# Altium project ECUCheater_New.PrjPCB
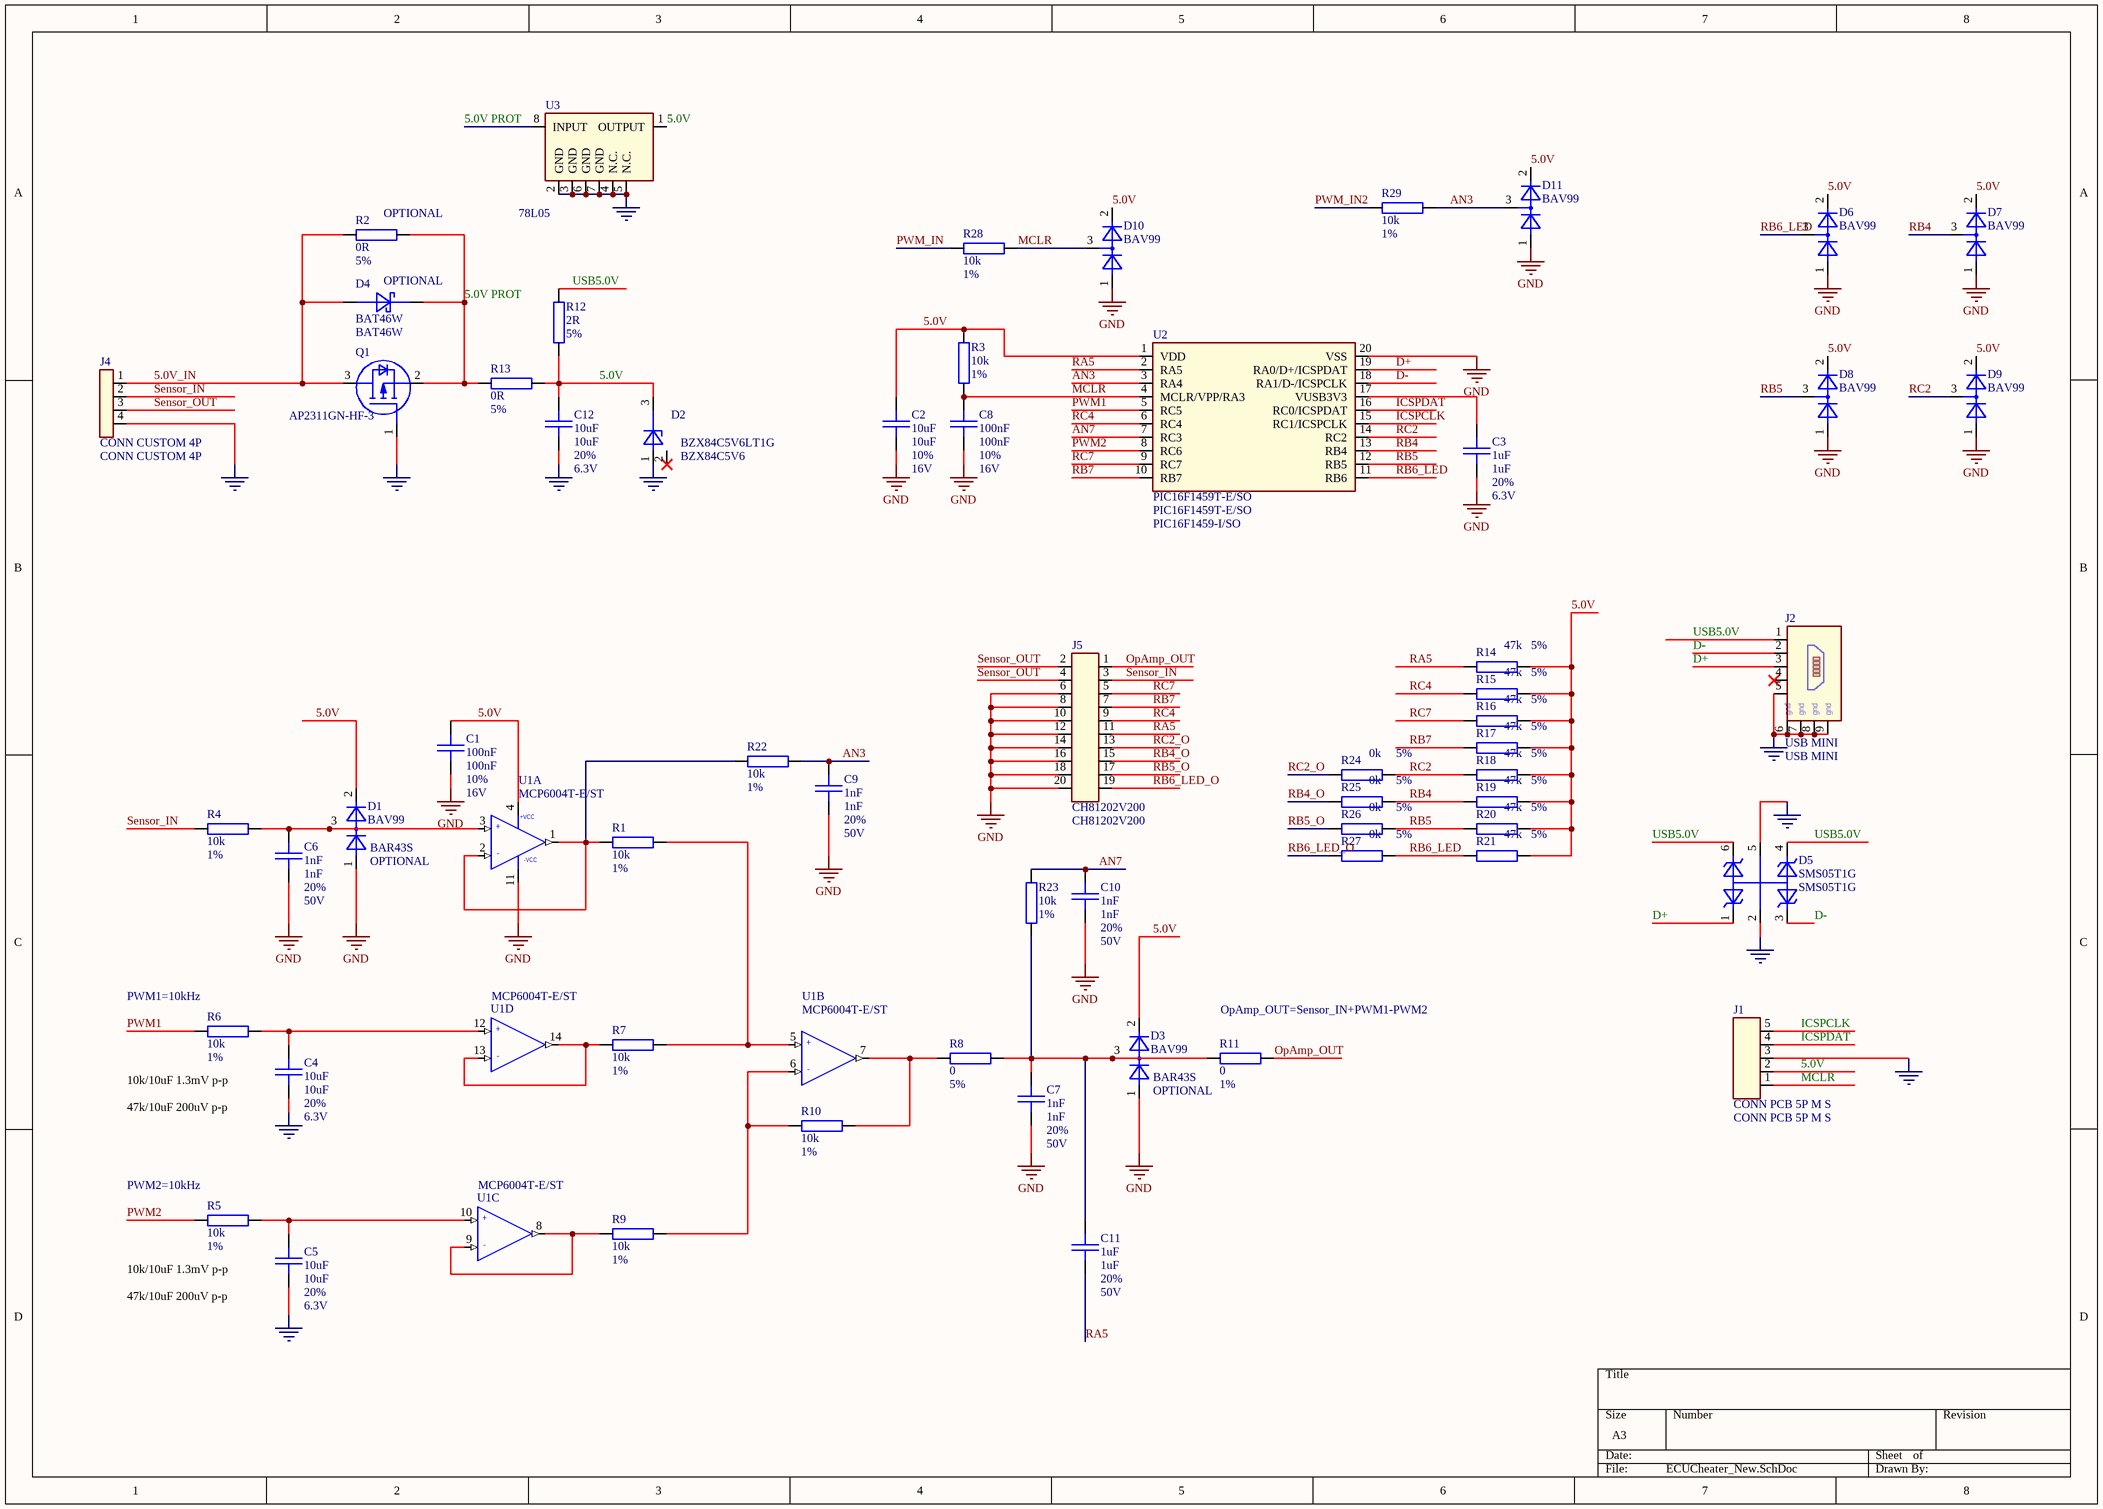
[diagram p0: ECUCheater_New.SchDoc]
1 sheet, 60 parts. Net scope: flat (ports and power ports of the same name join across sheets).
Board file: ECUCheater_New.PcbDoc

## Sheet ECUCheater_New.SchDoc
size A3

### Parts
C1  100nF  DB_TOLERANCE: 10%  DB_VOLTAGE: 16V  [SMD_0805_CAPC2012X145N]
C2  10uF  DB_TOLERANCE: 10%  DB_VOLTAGE: 16V  [SMD_0805_CAPC2012X145N]
C3  1uF  DB_TOLERANCE: 20%  DB_VOLTAGE: 6.3V  [SMD_0805_CAPC2012X145N]
C4  10uF  DB_TOLERANCE: 20%  DB_VOLTAGE: 6.3V  [SMD_0805_CAPC2012X145N]
C5  10uF  DB_TOLERANCE: 20%  DB_VOLTAGE: 6.3V  [SMD_0805_CAPC2012X145N]
C6  1nF  DB_TOLERANCE: 20%  DB_VOLTAGE: 50V  [SMD_0805_CAPC2012X145N]
C7  1nF  DB_TOLERANCE: 20%  DB_VOLTAGE: 50V  [SMD_0805_CAPC2012X145N]
C8  100nF  DB_TOLERANCE: 10%  DB_VOLTAGE: 16V  [SMD_0805_CAPC2012X145N]
C9  1nF  DB_TOLERANCE: 20%  DB_VOLTAGE: 50V  [SMD_0805_CAPC2012X145N]
C10  1nF  DB_TOLERANCE: 20%  DB_VOLTAGE: 50V  [SMD_0805_CAPC2012X145N]
C11  1uF  DB_TOLERANCE: 20%  DB_VOLTAGE: 50V  [SMD_0805_CAPC2012X145N]
C12  10uF  DB_TOLERANCE: 20%  DB_VOLTAGE: 6.3V  [SMD_0805_CAPC2012X145N]
D1  BAV99  [SMD_SOT23_SOT92P240X110-3N]
D2  BZX84C5V6LT1G  [SMD_SOT23_SOT95P240X112-3N]
D3  BAV99  [SMD_SOT23_SOT92P240X110-3N]
D4  BAT46W  [SMD_R_SOD123_SOD3715X145N]
D5  SMS05T1G  [SMD_SOT95P280X145-6N-W]
D6  BAV99  [SMD_SOT23_SOT92P240X110-3N]
D7  BAV99  [SMD_SOT23_SOT92P240X110-3N]
D8  BAV99  [SMD_SOT23_SOT92P240X110-3N]
D9  BAV99  [SMD_SOT23_SOT92P240X110-3N]
D10  BAV99  [SMD_SOT23_SOT92P240X110-3N]
D11  BAV99  [SMD_SOT23_SOT92P240X110-3N]
J1  CONN PCB 5P M S  [SIP5 - PGM]
J2  USB MINI  [SMD_CON-CVILUX-CU04-SCM15B0]
J4  CONN CUSTOM 4P  [PTH_CON_CUSTOM_10]
J5  CH81202V200  [PTH_HDRV40W6240P254_2X10_M]
Q1  BSH202  [SMD_SOT23_SOT95P230X110-3N]  (value not drawn)
R1  DB_TOLERANCE: 1%  [SMD_0805_RESC2012X130N]  (hidden comment: 10k)
R2  DB_TOLERANCE: 5%  [SMD_1206_RESC3216X65N]  (hidden comment: 0R)
R3  DB_TOLERANCE: 1%  [SMD_0805_RESC2012X130N]  (hidden comment: 10k)
R4  DB_TOLERANCE: 1%  [SMD_0805_RESC2012X130N]  (hidden comment: 10k)
R5  DB_TOLERANCE: 1%  [SMD_0805_RESC2012X130N]  (hidden comment: 10k)
R6  DB_TOLERANCE: 1%  [SMD_0805_RESC2012X130N]  (hidden comment: 10k)
R7  DB_TOLERANCE: 1%  [SMD_0805_RESC2012X130N]  (hidden comment: 10k)
R8  DB_TOLERANCE: 5%  [SMD_0805_RESC2012X130N]  (hidden comment: 0)
R9  DB_TOLERANCE: 1%  [SMD_0805_RESC2012X130N]  (hidden comment: 10k)
R10  DB_TOLERANCE: 1%  [SMD_0805_RESC2012X130N]  (hidden comment: 10k)
R11  DB_TOLERANCE: 1%  [SMD_0805_RESC2012X130N]  (hidden comment: 0)
R12  DB_TOLERANCE: 5%  [SMD_1206_RESC3216X65N]  (hidden comment: 2R)
R13  DB_TOLERANCE: 5%  [SMD_1206_RESC3216X65N]  (hidden comment: 0R)
R14  DB_TOLERANCE: 5%  [SMD_0805_RESC2012X130N]  (hidden comment: 47k)
R15  DB_TOLERANCE: 5%  [SMD_0805_RESC2012X130N]  (hidden comment: 47k)
R16  DB_TOLERANCE: 5%  [SMD_0805_RESC2012X130N]  (hidden comment: 47k)
R17  DB_TOLERANCE: 5%  [SMD_0805_RESC2012X130N]  (hidden comment: 47k)
R18  DB_TOLERANCE: 5%  [SMD_0805_RESC2012X130N]  (hidden comment: 47k)
R19  DB_TOLERANCE: 5%  [SMD_0805_RESC2012X130N]  (hidden comment: 47k)
R20  DB_TOLERANCE: 5%  [SMD_0805_RESC2012X130N]  (hidden comment: 47k)
R21  DB_TOLERANCE: 5%  [SMD_0805_RESC2012X130N]  (hidden comment: 47k)
R22  DB_TOLERANCE: 1%  [SMD_0805_RESC2012X130N]  (hidden comment: 10k)
R23  DB_TOLERANCE: 1%  [SMD_0805_RESC2012X130N]  (hidden comment: 10k)
R24  DB_TOLERANCE: 5%  [SMD_0805_RESC2012X130N]  (hidden comment: 0k)
R25  DB_TOLERANCE: 5%  [SMD_0805_RESC2012X130N]  (hidden comment: 0k)
R26  DB_TOLERANCE: 5%  [SMD_0805_RESC2012X130N]  (hidden comment: 0k)
R27  DB_TOLERANCE: 5%  [SMD_0805_RESC2012X130N]  (hidden comment: 0k)
R28  DB_TOLERANCE: 1%  [SMD_0805_RESC2012X130N]  (hidden comment: 10k)
R29  DB_TOLERANCE: 1%  [SMD_0805_RESC2012X130N]  (hidden comment: 10k)
U1  MCP6004T-E/ST  [SMD_SOIC127P600X175-14N]  (parts A,B,C,D of 4)
U2  PIC16F1459T-E/SO  [SMD_SOIC127P1030X265-20N]
U3  78L05  [SMD_SOIC127P602X173-8N]

### Nets
GND: C1.2 C2.2 C3.2 C4.2 C5.2 C6.2 C7.2 C8.2 C9.2 C10.2 C12.2 D1.1(A) D2.1(A) D3.1(A) D5.2 D5.5 D6.1(A) D7.1(A) D8.1(A) D9.1(A) D10.1(A) D11.1(A) J1.3 J2.5 J2.6 J2.7 J2.8 J2.9 J4.4 J5.6 J5.8 J5.10 J5.12 J5.14 J5.16 J5.18 J5.20 Q1.1(G) U1.11(-VCC) U2.20(VSS) U3.2(GND) U3.3(GND) U3.4(N.C.) U3.5(N.C.) U3.6(GND) U3.7(GND)
5.0V: C1.1 C2.1 C12.1 D1.2(C) D2.3(C) D3.2(C) D6.2(C) D7.2(C) D8.2(C) D9.2(C) D10.2(C) D11.2(C) J1.2 R3.2 R12.1 R13.1 R14.2 R15.2 R16.2 R17.2 R18.2 R19.2 R20.2 R21.2 U1.4(+VCC) U2.1(VDD) U3.1(OUTPUT)
5.0V PROT: D4.1(C) Q1.2(S) R2.1 R13.2 U3.8(INPUT)
5.0V_IN: D4.2(A) J4.1 Q1.3(D) R2.2
AN3: C9.1 D11.3(AC) R22.1 R29.1 U2.3(RA4)
AN7: C10.1 R23.1 U2.7(RC3)
D+: D5.1 J2.3 U2.19(RA0/D+/ICSPDAT)
D-: D5.3 J2.2 U2.18(RA1/D-/ICSPCLK)
ICSPCLK: J1.5 U2.15(RC1/ICSPCLK)
ICSPDAT: J1.4 U2.16(RC0/ICSPDAT)
MCLR: C8.1 D10.3(AC) J1.1 R3.1 R28.1 U2.4(MCLR/VPP/RA3)
OpAmp_OUT: J5.1 R11.1
PWM1: R6.2 U2.5(RC5)
PWM2: R5.2 U2.8(RC6)
PWM_IN: R28.2
PWM_IN2: R29.2
RA5: C11.2 J5.11 R14.1 U2.2(RA5)
RB4: D7.3(AC) R19.1 R25.2 U2.13(RB4)
RB4_O: J5.15 R25.1
RB5: D8.3(AC) R20.1 R26.2 U2.12(RB5)
RB5_O: J5.17 R26.1
RB6_LED: D6.3(AC) R21.1 R27.2 U2.11(RB6)
RB6_LED_O: J5.19 R27.1
RB7: J5.7 R17.1 U2.10(RB7)
RC2: D9.3(AC) R18.1 R24.2 U2.14(RC2)
RC2_O: J5.13 R24.1
RC4: J5.9 R15.1 U2.6(RC4)
RC7: J5.5 R16.1 U2.9(RC7)
Sensor_IN: J4.2 J5.3 R4.2
Sensor_OUT: J4.3 J5.2 J5.4
USB5.0V: D5.4 D5.6 J2.1 R12.2
NetC3_1: C3.1 U2.17(VUSB3V3)
NetC4_1: C4.1 R6.1 U1.12(+IN)
NetC5_1: C5.1 R5.1 U1.10(+IN)
NetC6_1: C6.1 D1.3(AC) R4.1 U1.3(+IN)
NetC7_1: C7.1 C11.1 D3.3(AC) R8.1 R11.2 R23.2
NetR1_1: R1.1 R7.1 U1.5(+IN)
NetR1_2: R1.2 R22.2 U1.1(OUT) U1.2(-IN)
NetR7_2: R7.2 U1.13(-IN) U1.14(OUT)
NetR8_2: R8.2 R10.1 U1.7(OUT)
NetR9_1: R9.1 R10.2 U1.6(-IN)
NetR9_2: R9.2 U1.8(OUT) U1.9(-IN)

Not connected (* = marked no-connect by the designer): D2 2(NC)*; J2 4*

### Notes on the sheet
- (near R2) OPTIONAL
- (near D4) OPTIONAL
- (near Q1) AP2311GN-HF-3
- (near D2) BZX84C5V6
- (near U2) PIC16F1459-I/SO
- (near D1) BAR43S
- (near D1) OPTIONAL
- (near R6) PWM1=10kHz
- (near R11) OpAmp_OUT=Sensor_IN+PWM1-PWM2
- 10k/10uF 1.3mV p-p
  47k/10uF 200uV p-p
- (near D3) BAR43S
- (near D3) OPTIONAL
- (near R5) PWM2=10kHz
- (in symbol ANA000000050, part A) +; -
- (in symbol ANA000000050, part B) +; -
- (in symbol ANA000000050, part C) +; -
- (in symbol ANA000000050, part D) +; -
- (in symbol CON000000048) gnd

### Library data of the parts
C1 C2 C8 = CAP000022730: DB_PART_TYPE: Ceramic_SMD\Open_Mode_X7R; DB_MANUFACTURER_PART: KEMET    C0603F104K4RAC; NOTE: <NOTE>; DB_T_RANGE: -55 to 125; DB_PACKAGE: 0603; DB_DESCRIPTION: C X7R 100nF 10% 16V 0603; DB_PCB_DEVICE: SMD_0603_CAPC1608X95N; DB_APPROVED_ON: 09.10.2010 г.; DB_STATUS: NEW; DB_PART_NUMBER: CAP000022730; DB_DATASHEET: http://john.epiqdesign.com/projects/CIS_Datasheets/F3102_CE_Kemet.pdf?rev=92&sc=0
  C1 C8: DB_VALUE: 100nF
  C2: DB_VALUE: 10uF
C3 = CAP000043344: DB_PART_TYPE: Ceramic_SMD\Standard_X5R; DB_MANUFACTURER_PART: KEMET    C0603C105M9PAC; NOTE: <NOTE>; DB_T_RANGE: -55 to 85; DB_PACKAGE: 0603; DB_DESCRIPTION: C X5R 1uF 20% 6.3V 0603; DB_PCB_DEVICE: SMD_0603_CAPC1608X95N; DB_APPROVED_ON: 09.10.2010 г.; DB_STATUS: NEW; DB_PART_NUMBER: CAP000043344; DB_VALUE: 1uF; DB_DATASHEET: http://john.epiqdesign.com/projects/CIS_Datasheets/F3102_CE_Kemet.pdf?rev=92&sc=0
C4 C5 = CAP000043646: DB_PART_TYPE: Ceramic_SMD\Standard_X5R; DB_MANUFACTURER_PART: KEMET    C0603C106M9PAC; NOTE: <NOTE>; DB_T_RANGE: -55 to 85; DB_PACKAGE: 0603; DB_DESCRIPTION: C X5R 10uF 20% 6.3V 0603; DB_PCB_DEVICE: SMD_0603_CAPC1608X95N; DB_APPROVED_ON: 09.10.2010 г.; DB_STATUS: NEW; DB_PART_NUMBER: CAP000043646; DB_VALUE: 10uF; DB_DATASHEET: http://john.epiqdesign.com/projects/CIS_Datasheets/F3102_CE_Kemet.pdf?rev=92&sc=0
C6 C7 C9-C11 = CAP000025544: DB_PART_TYPE: Ceramic_SMD\Standard_X7R; DB_MANUFACTURER_PART: KEMET    C0603C103M5RAC; NOTE: <NOTE>; DB_T_RANGE: -55 to 125; DB_PACKAGE: 0603; DB_DESCRIPTION: C X7R 10nF 20% 50V 0603; DB_PCB_DEVICE: SMD_0603_CAPC1608X95N; DB_APPROVED_ON: 09.10.2010 г.; DB_STATUS: NEW; DB_PART_NUMBER: CAP000025544; DB_DATASHEET: http://john.epiqdesign.com/projects/CIS_Datasheets/F3102_CE_Kemet.pdf?rev=92&sc=0
  C6 C7 C9 C10: DB_VALUE: 1nF
  C11: DB_VALUE: 1uF
C12 = CAP000043646: DB_MANUFACTURER_PART: KEMET    C0603C106M9PAC; DB_PART_TYPE: Ceramic_SMD\Standard_X5R; NOTE: <NOTE>; DB_APPROVED_ON: 09.10.2010 г.; DB_DESCRIPTION: C X5R 10uF 20% 6.3V 0603; DB_PACKAGE: 0603; DB_PCB_DEVICE: SMD_0603_CAPC1608X95N; DB_STATUS: NEW; DB_T_RANGE: -55 to 85; DB_PART_NUMBER: CAP000043646; DB_VALUE: 10uF; DB_DATASHEET: http://john.epiqdesign.com/projects/CIS_Datasheets/F3102_CE_Kemet.pdf?rev=92&sc=0
D1 D3 D6-D11 = DDE000002707: DB_PART_TYPE: Fast; DB_MANUFACTURER_PART: Diodes        BAV99-7-F; NOTE: <NOTE>; DB_T_RANGE: -65 to 150; DB_VOLTAGE: 75V; DB_CURRENT: 300mA; DB_PACKAGE: SOT-23; DB_DESCRIPTION: D BAV99 SOT23; DB_CERTIFIED: AUT; DB_APPROVED_BY: VSN; DB_APPROVED_ON: 18.4.2011 г. 14:45:41; DB_STATUS: NEW; DB_PART_NUMBER: DDE000002707; DB_VALUE: BAV99; DB_PCB_DEVICE: SMD_SOT23_SOT92P240X110-3N; DB_DATASHEET: http://john.epiqdesign.com/projects/CIS_Datasheets/BAV99_DIODES.pdf?rev=239&sc=0
D2 = DDE000002715: DB_PART_TYPE: Zener; DB_MANUFACTURER_PART: ON Semiconductor       BZX84C5V6LT1G; NOTE: <NOTE>; DB_T_RANGE: -65 to 150; DB_VOLTAGE: 5.6V; DB_CURRENT: 5mA; DB_PACKAGE: SOT-23; DB_DESCRIPTION: D  ZEN  BZX84C5V6  SOT-23; DB_CERTIFIED: AUT; DB_APPROVED_BY: VSN; DB_APPROVED_ON: 03.5.2011 г. 11:02:04; DB_STATUS: NEW; DB_PART_NUMBER: DDE000002715; DB_VALUE: BZX84C5V6LT1G; DB_PCB_DEVICE: SMD_SOT23_SOT95P240X112-3N; DB_DATASHEET: http://john.epiqdesign.com/projects/CIS_Datasheets/ZENER_AUT_BZX84C5V6LT1G_On_Semiconductors.pdf?rev=265&sc=0
D4 = DDE000000481: DB_PART_TYPE: Schottky; DB_MANUFACTURER_PART: Diodes        BAT46W; NOTE: <NOTE>; DB_T_RANGE: -55 to +125; DB_VOLTAGE: 100V; DB_CURRENT: 150mA; DB_PACKAGE: SOD123; DB_DESCRIPTION: D BAT46W SOD123; DB_APPROVED_ON: 09.10.2010 г.; DB_STATUS: NEW; DB_PART_NUMBER: DDE000000481; DB_VALUE: BAT46W; DB_PCB_DEVICE: SMD_R_SOD123_SOD3715X145N
D5 = DDE000002846: DB_PART_TYPE: ESD protection; DB_MANUFACTURER_PART: ON SEMICONDUCTOR        SMS05T1G; DB_T_RANGE: -55 to 150; DB_VOLTAGE: 5V; DB_PACKAGE: SC-74; DB_DESCRIPTION: D SMS05T1G SC-74; DB_PCB_DEVICE: SMD_SOT457_SOT95P275X110-6N; DB_APPROVED_BY: VSN; DB_APPROVED_ON: 24.3.2014 г. 10:22:08; DB_STATUS: NEW; DB_PART_NUMBER: DDE000002846; DB_VALUE: SMS05T1G; DB_DATASHEET: http://john.epiqdesign.com/projects/CIS_Datasheets/IC_SMS05T1-D.pdf?rev=1323&sc=0
J1 = CON000000006: DB_PART_TYPE: Connector; DB_MANUFACTURER_PART: W+P        143-12-005-00; NOTE: <NOTE>; DB_T_RANGE: -55 to 125; DB_PACKAGE: PTH; DB_DESCRIPTION: CONN PCB 5P M S 143-12-005-00; DB_PCB_DEVICE: PTH_HDRV05W64P254_1X05; DB_APPROVED_BY: VSN; DB_APPROVED_ON: 14.12.2010 г. 10:22:07; DB_STATUS: NEW; DB_PART_NUMBER: CON000000006; DB_VALUE: CONN PCB 5P M S; DB_DATASHEET: http://john.epiqdesign.com/projects/CIS_Datasheets/143-12-005-00_W+P.pdf?rev=3&sc=0
J2 = CON000000048: DB_PART_TYPE: Connector; DB_MANUFACTURER_PART: CVILUX       CU04-SCM15B0-R0-LF; NOTE: <NOTE>; DB_PINS_NUMBER: 5; DB_PITCH: 0.8; DB_PACKAGE: SMD; DB_DESCRIPTION: CONN  PCB  5P  F  A  USB5 MINI SMD; DB_APPROVED_BY: VSN; DB_APPROVED_ON: 02.5.2011 г. 10:29:38; DB_STATUS: NEW; DB_PART_NUMBER: CON000000048; DB_VALUE: USB MINI; DB_PCB_DEVICE: SMD_CON-CVILUX-CU04-SCM15B0; DB_DATASHEET: http://john.epiqdesign.com/projects/CIS_Datasheets/USB%20MINI_CVILUX.pdf?rev=249&sc=0
J4 = CON000000197: DB_PART_TYPE: Connector; DB_MANUFACTURER_PART: CUSTOM CONNECTOR for prj. 730480; DB_PINS_NUMBER: 4; DB_PITCH: 5mm; DB_PACKAGE: PTH; DB_APPROVED_BY: VSN; DB_APPROVED_ON: 15.11.2013 г. 12:25:12; DB_STATUS: NEW; DB_PART_NUMBER: CON000000197; DB_VALUE: CONN CUSTOM 4P; DB_DESCRIPTION: CONN CUSTOM 4P; DB_PCB_DEVICE: PTH_CON_CUSTOM_10; DB_DATASHEET: http://john.epiqdesign.com/projects/CIS_Datasheets/Connector_Housing_Custom_for%20730480-2.pdf?rev=1297&sc=0
J5 = CON000000290: DB_PART_TYPE: Connector; DB_MANUFACTURER_PART: CVILUX        CH81202V200; DB_PINS_NUMBER: 20; DB_PITCH: 2.54mm; DB_PACKAGE: PTH; DB_DESCRIPTION: CONN PCB 20P M S PTH; DB_APPROVED_BY: VSN; DB_APPROVED_ON: 31.5.2014 г. 14:59:56; DB_STATUS: NEW; DB_PART_NUMBER: CON000000290; DB_VALUE: CH81202V200; DB_PCB_DEVICE: PTH_HDRV40W6240P254_2X10_M; DB_DATASHEET: http://john.epiqdesign.com/projects/CIS_Datasheets/CON_CH81XX2H200.pdf?rev=1328&sc=0
Q1 = TRA000000687: DB_PART_TYPE: MOSFET\P_Channel; DB_MANUFACTURER_PART: NXP        BSH202; NOTE: <NOTE>; DB_T_RANGE: -55 to 150; DB_VOLTAGE: 30V; DB_CURRENT: 0.52A; DB_PACKAGE: SOT23; DB_DESCRIPTION: TRANS BSH202 SOT23; DB_APPROVED_ON: 09.10.2010 г.; DB_STATUS: NEW; DB_PART_NUMBER: TRA000000687; DB_VALUE: BSH202; DB_PCB_DEVICE: SMD_SOT23_SOT95P230X110-3N; DB_DATASHEET: http://john.epiqdesign.com/projects/CIS_Datasheets/BSH202_NXP.pdf?rev=337&sc=0
R1 R3-R7 R9-R11 R22 R23 R28 R29 = RES000008663: DB_PART_TYPE: SMD; DB_MANUFACTURER_PART: YAGEO    RC0603FR-0710KL; NOTE: <NOTE>; DB_T_RANGE: -55 to 155; DB_POWER: 1/10W; DB_PACKAGE: 0603; DB_DESCRIPTION: R SMD 10k 1% 1/10W 0603; DB_PCB_DEVICE: SMD_0603_RESC1608X55N; DB_APPROVED_BY: VSN; DB_APPROVED_ON: 08.8.2011 г. 08:31:51; DB_STATUS: NEW; R_BDS: R; DB_PART_NUMBER: RES000008663; DB_DATASHEET: http://john.epiqdesign.com/projects/CIS_Datasheets/PYu-RC0603_51_RoHS_L_4_YAGEO.pdf?rev=138&sc=0
  R1 R3-R7 R9 R10 R22 R23 R28 R29: DB_VALUE: 10k
  R11: DB_VALUE: 0
R2 R12 R13 = RES000007051: DB_PART_TYPE: SMD; DB_MANUFACTURER_PART: YAGEO    RC1206JR-072R; NOTE: <NOTE>; DB_T_RANGE: -55 to 155; DB_POWER: 1/4W; DB_PACKAGE: 1206; DB_DESCRIPTION: R SMD 2R 5% 1/4W 1206; DB_APPROVED_ON: 09.10.2010 г.; DB_STATUS: NEW; R_BDS: R; DB_PART_NUMBER: RES000007051; DB_PCB_DEVICE: SMD_1206_RESC3216X65N; DB_DATASHEET: http://john.epiqdesign.com/projects/CIS_Datasheets/PYu-RC1206_51_RoHS_L_4_YAGEO.pdf?rev=138&sc=0
  R2 R13: DB_VALUE: 0R
  R12: DB_VALUE: 2R
R8 = RES000006422: DB_PART_TYPE: SMD; DB_MANUFACTURER_PART: YAGEO    RC0603JR-071K; NOTE: <NOTE>; DB_T_RANGE: -55 to 155; DB_POWER: 1/10W; DB_PACKAGE: 0603; DB_DESCRIPTION: R SMD 1K 5% 1/10W 0603; DB_PCB_DEVICE: SMD_0603_RESC1608X55N; DB_PRICE: 0.000364; DB_MOQ: 5000; DB_APPROVED_ON: 09.10.2010 г.; DB_STATUS: NEW; R_BDS: R; DB_PART_NUMBER: RES000006422; DB_VALUE: 0; DB_PRICE_DATE: 2010-12-23; DB_DATASHEET: http://john.epiqdesign.com/projects/CIS_Datasheets/PYu-RC0603_51_RoHS_L_4_YAGEO.pdf?rev=138&sc=0
R14-R21 R24-R27 = RES000006462: DB_PART_TYPE: SMD; DB_MANUFACTURER_PART: YAGEO    RC0603JR-0747K; NOTE: <NOTE>; DB_T_RANGE: -55 to 155; DB_POWER: 1/10W; DB_PACKAGE: 0603; DB_DESCRIPTION: R SMD 47K 5% 1/10W 0603; DB_PCB_DEVICE: SMD_0603_RESC1608X55N; DB_PRICE: 0.000364; DB_MOQ: 5000; DB_APPROVED_ON: 09.10.2010 г.; DB_STATUS: NEW; R_BDS: R; DB_PART_NUMBER: RES000006462; DB_PRICE_DATE: 2010-12-23; DB_DATASHEET: http://john.epiqdesign.com/projects/CIS_Datasheets/PYu-RC0603_51_RoHS_L_4_YAGEO.pdf?rev=138&sc=0
  R14-R21: DB_VALUE: 47k
  R24-R27: DB_VALUE: 0k
U1 = ANA000000050: DB_PART_TYPE: OP_AMP; DB_MANUFACTURER_PART: MICROCHIP    MCP6004T-E/STVAO; NOTE: <NOTE>; DB_T_RANGE: -40 to 125; DB_PACKAGE: TSSOP; DB_DESCRIPTION: IC MCP6004T-E/ST TSSOP; DB_PCB_DEVICE: SMD_SOP65P640X120-14N; DB_CERTIFIED: AUT; DB_APPROVED_BY: RKR; DB_APPROVED_ON: 04.3.2013 г. 17:15:56; DB_STATUS: NEW; DB_PART_NUMBER: ANA000000050; DB_VALUE: MCP6004T-E/ST; DB_DATASHEET: http://john.epiqdesign.com/projects/CIS_Datasheets/MCP6001T-E_OT_1MHz_Op_Amp_Microchip_Auto.pdf?rev=298&sc=0
U2 = MCU000000108: DB_PART_TYPE: Microchip; DB_MANUFACTURER_PART: Microchip        PIC16F1459T-E/SO; DB_T_RANGE: -40 to 125; DB_PACKAGE: SOIC-20; DB_DESCRIPTION: IC  PIC16F1459T-E/SO  SOIC-20; DB_APPROVED_BY: VSN; DB_APPROVED_ON: 16.1.2015 г. 12:54:38; DB_STATUS: NEW; DB_PART_NUMBER: MCU000000108; DB_VALUE: PIC16F1459T-E/SO; DB_PCB_DEVICE: SMD_SOIC127P1030X265-20N; DB_DATASHEET: http://john.epiqdesign.com/projects/CIS_Datasheets/IC_PIC16F1459.pdf?rev=1594&sc=0
U3 = IC_LM2931AD-5.0R2G_SO-8

## Assembly variants
Mitko Filipov: not fitted C8 C11 D2 D4 D6 D7 D8 D9 D10 D11 Q1 R3 R14 R15 R16 R17 R18 R19 R20 R21 R24 R25 R26 R27 R28 R29 U3